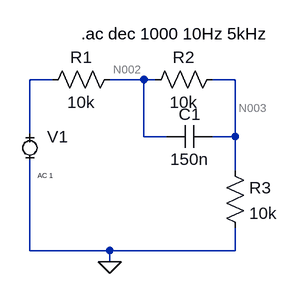
[diagram p0: schematic Draft1.asc]
Draft1.asc, the LTspice schematic file:
Version 4
SHEET 1 880 680
WIRE 48 96 16 96
WIRE 176 96 128 96
WIRE 192 96 176 96
WIRE 304 96 272 96
WIRE 16 176 16 96
WIRE 176 176 176 96
WIRE 208 176 176 176
WIRE 304 176 304 96
WIRE 304 176 272 176
WIRE 304 224 304 176
WIRE 16 336 16 208
WIRE 128 336 16 336
WIRE 304 336 304 304
WIRE 304 336 128 336
WIRE 128 352 128 336
FLAG 128 352 0
SYMBOL MiniSyms4\\voltage- 16 192 R0
WINDOW 123 11 39 Left 0
WINDOW 39 0 0 Left 0
SYMATTR Value2 AC 1
SYMATTR InstName V1
SYMATTR Value ""
SYMBOL res 144 80 R90
WINDOW 0 0 56 VBottom 2
WINDOW 3 32 56 VTop 2
SYMATTR InstName R1
SYMATTR Value 10k
SYMBOL res 288 80 R90
WINDOW 0 0 56 VBottom 2
WINDOW 3 32 56 VTop 2
SYMATTR InstName R2
SYMATTR Value 10k
SYMBOL cap 272 160 R90
WINDOW 0 0 32 VBottom 2
WINDOW 3 32 32 VTop 2
SYMATTR InstName C1
SYMATTR Value 150n
SYMBOL res 288 208 R0
SYMATTR InstName R3
SYMATTR Value 10k
TEXT 88 32 Left 2 !.ac dec 1000 10Hz 5kHz

The netlist it stands for:
* Draft1.asc
V1 N001 0 AC 1
R1 N002 N001 10k
R2 N003 N002 10k
C1 N003 N002 150n
R3 N003 0 10k
.ac dec 1000 10Hz 5kHz
.backanno
.end

* Results of the author's LTspice run, read from the files saved beside the schematic
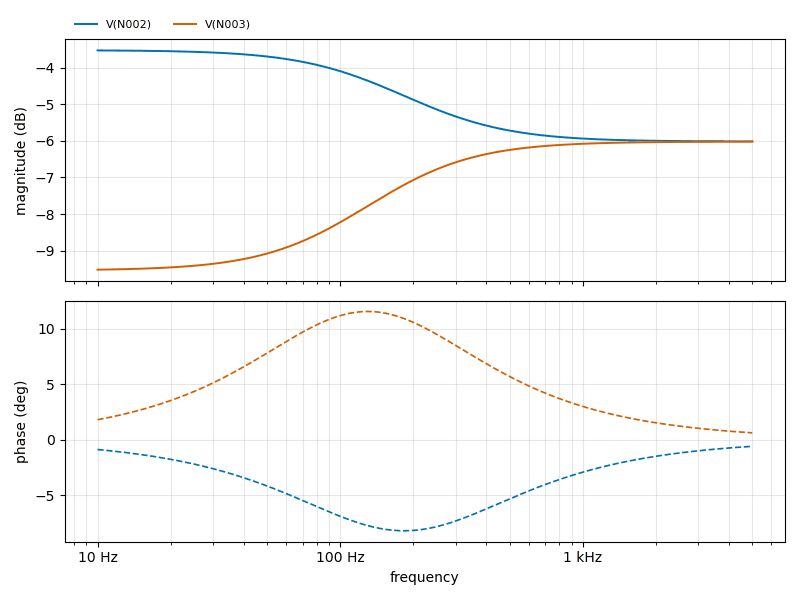
[diagram p1: AC Analysis of Draft1.asc, plotted from the saved traces]
* AC Analysis, 1 run:
*   V(N002): -3.53 dB at 10 Hz, -6.02 dB at 5 kHz, peak -3.53 dB at 10 Hz
*   V(N003): -9.52 dB at 10 Hz, -6.02 dB at 5 kHz, peak -6.02 dB at 5 kHz, 3 dB below the peak at 52.9 Hz